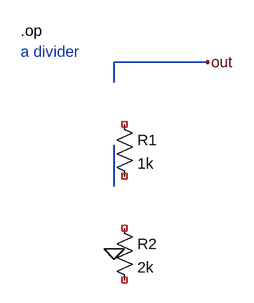
[diagram p0: schematic built.asc]
built.asc, the LTspice schematic file:
Version 4.1
SHEET 1 880 680
WIRE 304 64 160 64
WIRE 160 96 160 64
WIRE 160 256 160 192
FLAG 160 352 0
FLAG 304 64 out
SYMBOL res 160 144 R0
SYMATTR InstName R1
SYMATTR Value 1k
SYMBOL res 160 304 R0
SYMATTR InstName R2
SYMATTR Value 2k
TEXT 16 16 Left 2 !.op
TEXT 16 48 Left 2 ;a divider

The netlist it stands for:
* built.asc
R1 NC_01 NC_02 1k
R2 NC_03 NC_04 2k
.op
* a divider
.backanno
.end